# EAGLE design kachisys_board (EAGLE 9.0.0)
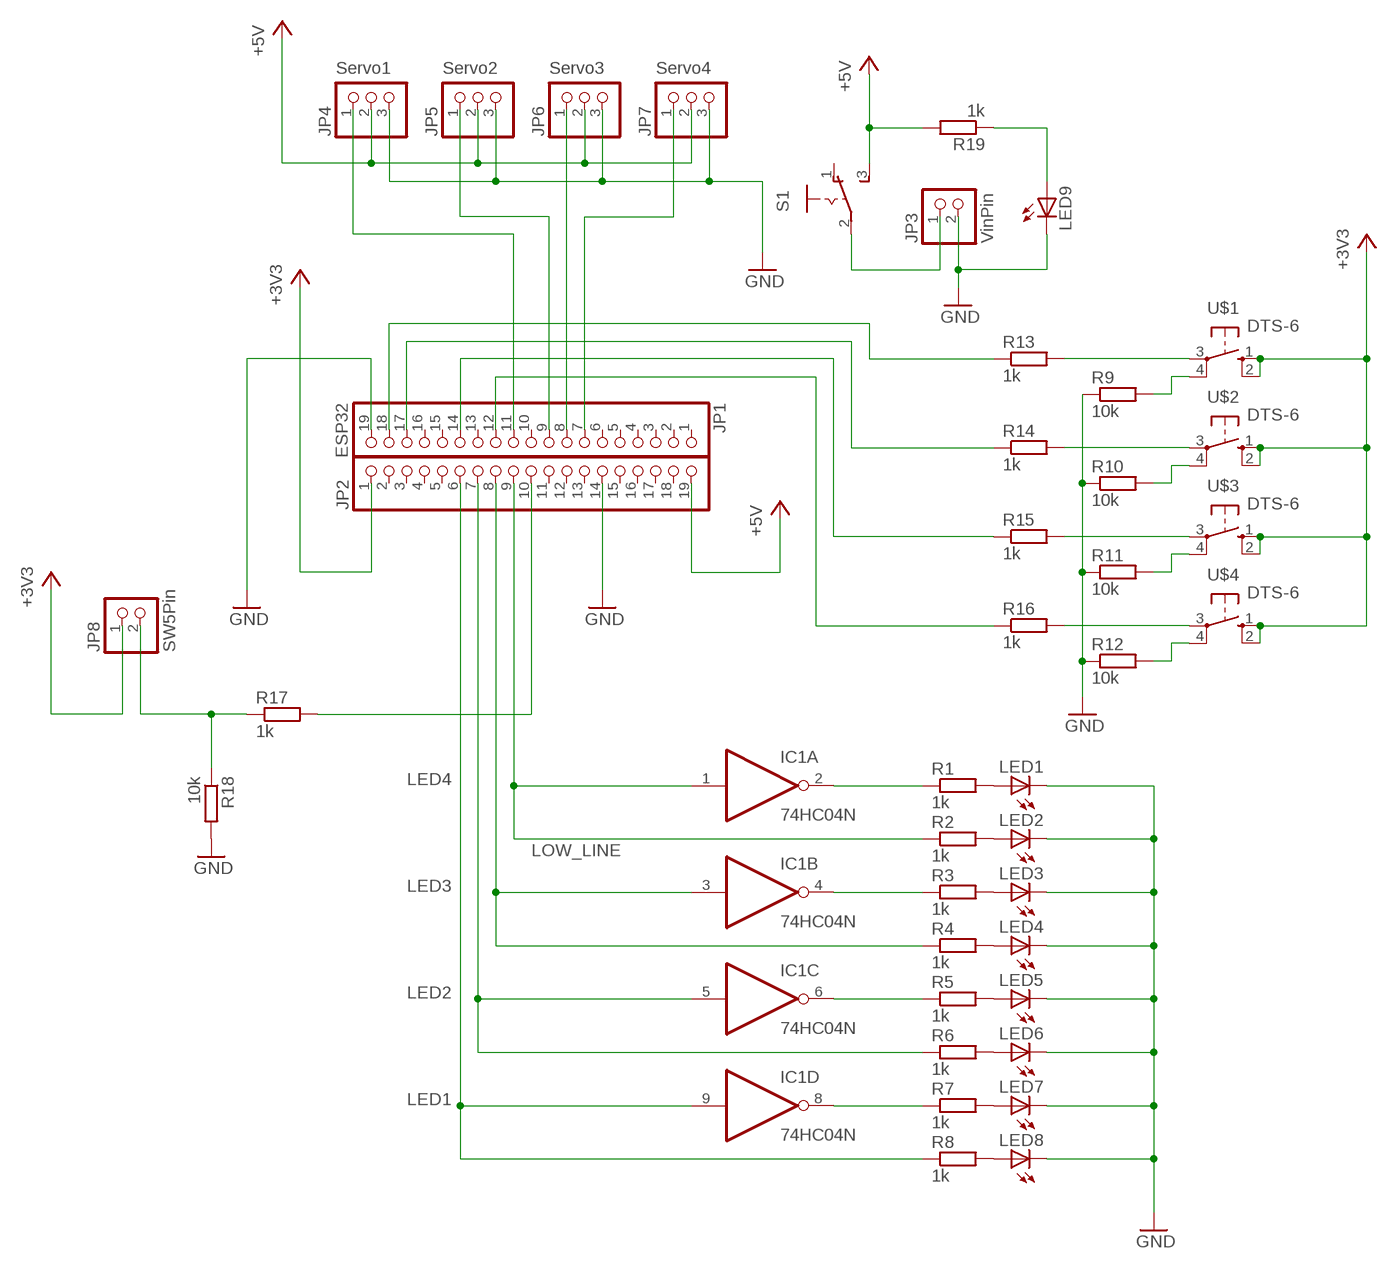
[diagram p0: schematic, sheet 1]

## Parts
IC1  74HC04N  [DIL14]
JP1  ESP32  PINHD-1X19  [1X19]
JP2  PINHD-1X19  [1X19]
JP3  VinPin  PINHD-1X2/90  [1X02/90]
JP4  PINHD-1X3  [1X03]
JP5  PINHD-1X3  [1X03]
JP6  PINHD-1X3  [1X03]
JP7  PINHD-1X3  [1X03]
JP8  SW5Pin  PINHD-1X2/90  [1X02/90]
LED1  LED3MM  [LED3MM]
LED2  LED3MM  [LED3MM]
LED3  LED3MM  [LED3MM]
LED4  LED3MM  [LED3MM]
LED5  LED3MM  [LED3MM]
LED6  LED3MM  [LED3MM]
LED7  LED3MM  [LED3MM]
LED8  LED3MM  [LED3MM]
LED9  LED3MM  [LED3MM]
R1  1k  R-EU_M2012  [M2012]
R2  1k  R-EU_M2012  [M2012]
R3  1k  R-EU_M2012  [M2012]
R4  1k  R-EU_M2012  [M2012]
R5  1k  R-EU_M2012  [M2012]
R6  1k  R-EU_M2012  [M2012]
R7  1k  R-EU_M2012  [M2012]
R8  1k  R-EU_M2012  [M2012]
R9  10k  R-EU_M2012  [M2012]
R10  10k  R-EU_M2012  [M2012]
R11  10k  R-EU_M2012  [M2012]
R12  10k  R-EU_M2012  [M2012]
R13  1k  R-EU_M2012  [M2012]
R14  1k  R-EU_M2012  [M2012]
R15  1k  R-EU_M2012  [M2012]
R16  1k  R-EU_M2012  [M2012]
R17  1k  R-EU_M2012  [M2012]
R18  10k  R-EU_M2012  [M2012]
R19  1k  R-EU_M2012  [M2012]
S1  255SB  [255SB]
U$1  DTS-6  [DTS6]
U$2  DTS-6  [DTS6]
U$3  DTS-6  [DTS6]
U$4  DTS-6  [DTS6]

## Nets
+3V3: JP2.1 JP8.1 U$1.1(S) U$1.2(S1) U$2.1(S) U$2.2(S1) U$3.1(S) U$3.2(S1) U$4.1(S) U$4.2(S1)
+5V [servoLine]: JP2.19 JP4.2 JP5.2 JP6.2 JP7.2 R19.2 S1.3(S)
GND [servoLine]: JP1.19 JP2.14 JP3.2 JP4.3 JP5.3 JP6.3 JP7.3 LED1.K(C) LED2.K(C) LED3.K(C) LED4.K(C) LED5.K(C) LED6.K(C) LED7.K(C) LED8.K(C) LED9.K(C) R9.1 R10.1 R11.1 R12.1 R18.2
N$1: IC1.9(D:I) JP2.6 R8.1
N$2: IC1.5(C:I) JP2.7 R6.1
N$3: IC1.3(B:I) JP2.8 R4.1
N$4: IC1.1(A:I) JP2.9 R2.1
N$5: IC1.2(A:O) R1.1
N$6: IC1.4(B:O) R3.1
N$7: IC1.6(C:O) R5.1
N$8: IC1.8(D:O) R7.1
N$9: LED1.A R1.2
N$10: LED2.A R2.2
N$11: LED3.A R3.2
N$12: LED4.A R4.2
N$13: LED5.A R5.2
N$14: LED6.A R6.2
N$15: LED7.A R7.2
N$16: LED8.A R8.2
N$17: R9.2 U$1.4(P1)
N$18: R10.2 U$2.4(P1)
N$19: R11.2 U$3.4(P1)
N$20: R12.2 U$4.4(P1)
N$21: JP8.2 R17.1 R18.1
N$22: R13.2 U$1.3(P)
N$23: R14.2 U$2.3(P)
N$24: R15.2 U$3.3(P)
N$25: JP1.7 JP7.1
N$26: JP1.8 JP6.1
N$27: JP1.9 JP5.1
N$28: JP1.11 JP4.1
N$29: R16.2 U$4.3(P)
N$30: JP1.12 R16.1
N$31: JP1.14 R15.1
N$32: JP1.17 R14.1
N$33: JP1.18 R13.1
N$34 [servoLine]: JP3.1 S1.2(P)
N$35 [servoLine]: LED9.A R19.1
N$37: JP2.10 R17.2
Unconnected: IC1.10(E:O) IC1.11(E:I) IC1.12(F:O) IC1.13(F:I) JP1.1 JP1.2 JP1.3 JP1.4 JP1.5 JP1.6 JP1.10 JP1.13 JP1.15 JP1.16 JP2.2 JP2.3 JP2.4 JP2.5 JP2.11 JP2.12 JP2.13 JP2.15 JP2.16 JP2.17 JP2.18 S1.1(O)

## Notes on the sheet
- Servo1 | Servo2 | Servo3 | Servo4
- LED4
- LOW_LINE
- LED3
- LED2
- LED1

## Power pins joined to a net without a drawn wire
GND: IC1.7(P:GND)
VCC: IC1.14(P:VCC)

## Library data of the parts
IC1 = 74xx-eu:74*04: Hex INVERTER
JP1 JP2 = pinhead:PINHD-1X19: PIN HEADER
JP3 JP8 = pinhead:PINHD-1X2: PIN HEADER
JP4-JP7 = pinhead:PINHD-1X3: PIN HEADER
LED1-LED9 = 150927 Library by matsu:LED: LED OSRAM: - CHIPLED LG R971, LG N971, LY N971, LG Q971, LY Q971, LO R971, LY R971 LH N974, LH R974 LS Q976, LO Q976, LY Q976 LO Q996 - Hyper CHIPLED LW Q18S LB Q993, LB Q99A, LB R99A - SideLED LS A670, LO A670, LY A670, LG A670, LP A670 LB A673, LV A673, LT A673, LW A673 LH A674 LY A675 LS A676, LA A676, LO A676, LY A676, LW A676 LS A679, LY A679, LG A679 - Hyper Micro SIDELED® LS Y876, LA Y876, LO Y876, LY Y876 LT Y87S - SmartLED LW L88C, LW L88S LB L89C, LB L89S, LG L890 LS L89K, LO L89K, LY L89K LS L896, LA L896, LO L896, LY L896 - TOPLED LS T670, LO T670, LY T670, LG T670, LP T670 LSG T670, LSP T670, LSY T670, LOP T670, LYG T670 LG T671, LOG T671, LSG T671 LB T673, LV T673, LT T673, LW T673 LH T674 LS T676, LA T676, LO T676, LY T676, LB T676, LH T676, LSB T676, LW T676 LB T67C, LV T67C, LT T67C, LS T67K, LO T67K, LY T67K, LW E67C LS E67B, LA E67B, LO E67B, LY E67B, LB E67C, LV E67C, LT E67C LW T67C LS T679, LY T679, LG T679 LS T770, LO T770, LY T770, LG T770, LP T770 LB T773, LV T773, LT T773, LW T773 LH T774 LS E675, LA E675, LY E675, LS T675 LS T776, LA T776, LO T776, LY T776, LB T776 LHGB T686 LT T68C, LB T68C - Hyper Mini TOPLED® LB M676 - Mini TOPLED Santana® LG M470 LS M47K, LO M47K, LY M47K Source: http://www.osram.convergy.de LUXEON: - LUMILED® LXK2-PW12-R00, LXK2-PW12-S00, LXK2-PW14-U00, LXK2-PW14-V00 LXK2-PM12-R00, LXK2-PM12-S00, LXK2-PM14-U00 LXK2-PE12-Q00, LXK2-PE12-R00, LXK2-PE12-S00, LXK2-PE14-T00, LXK2-PE14-U00 LXK2-PB12-K00, LXK2-PB12-L00, LXK2-PB12-M00, LXK2-PB14-N00, LXK2-PB14-P00, LXK2-PB14-Q00 LXK2-PR12-L00, LXK2-PR12-M00, LXK2-PR14-Q00, LXK2-PR14-R00 LXK2-PD12-Q00, LXK2-PD12-R00, LXK2-PD12-S00 LXK2-PH12-R00, LXK2-PH12-S00 LXK2-PL12-P00, LXK2-PL12-Q00, LXK2-PL12-R00 Source: www.luxeon.com KINGBRIGHT: KA-3528ASYC Source: www.kingbright.com
R1-R19 = 150927 Library by matsu:R-EU_: RESISTOR, European symbol
S1 = switch:255SB: SLIDING SWITCH Distributor Buerklin, 11G810
U$1-U$4 = 150927 Library by matsu:DTS-6: AKIZUKIDENSHI, Cosland Co,. Ltd. TACT SWITCH DTS-6 http://akizukidenshi.com/download/ds/cosland/DTS-6-V.PDF

## Net classes
0 default: width 0.508 mm
1 servoLine: width 1.016 mm

## Board
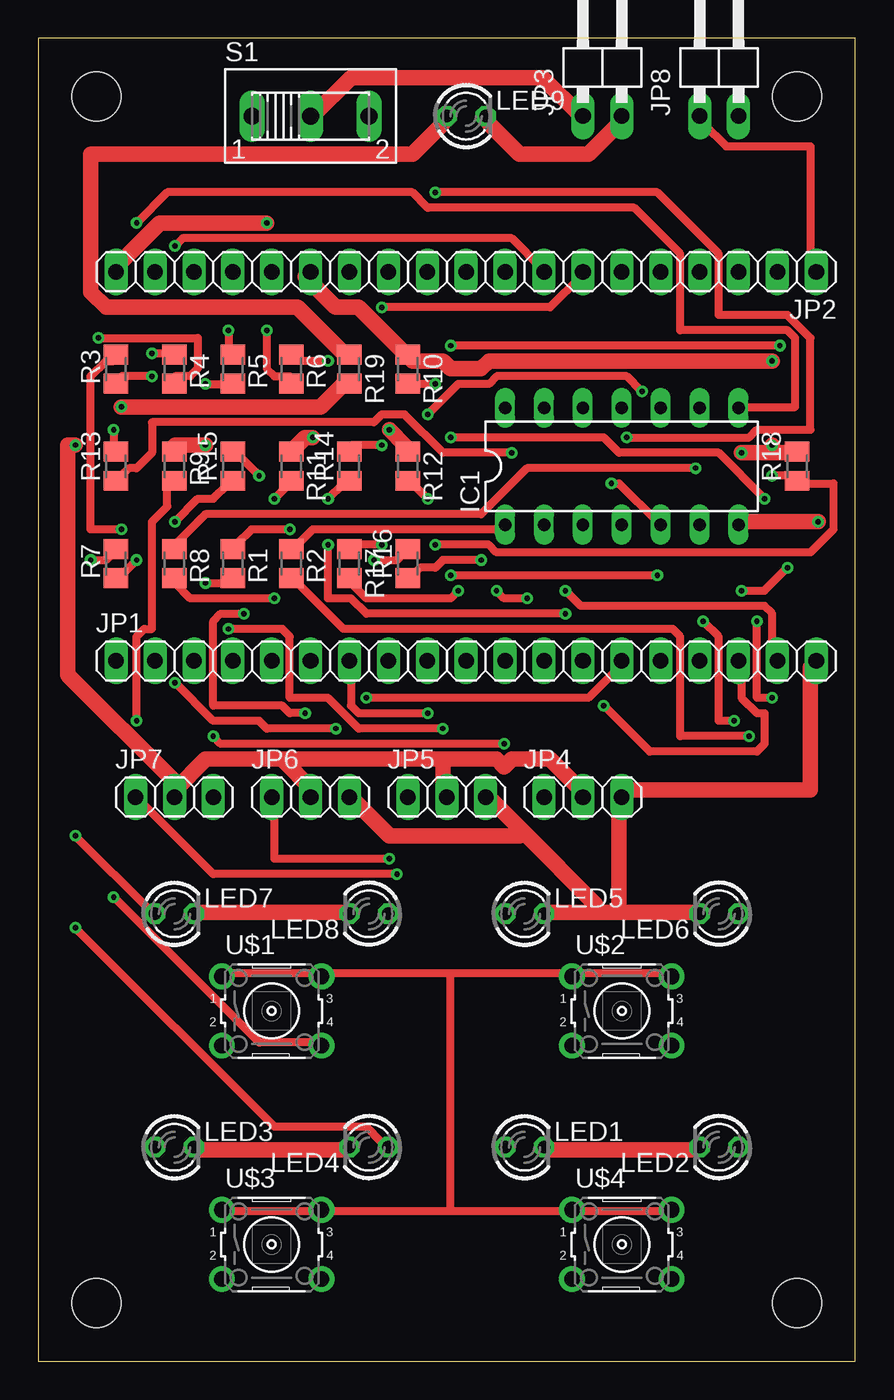
[diagram p1: board, top side]
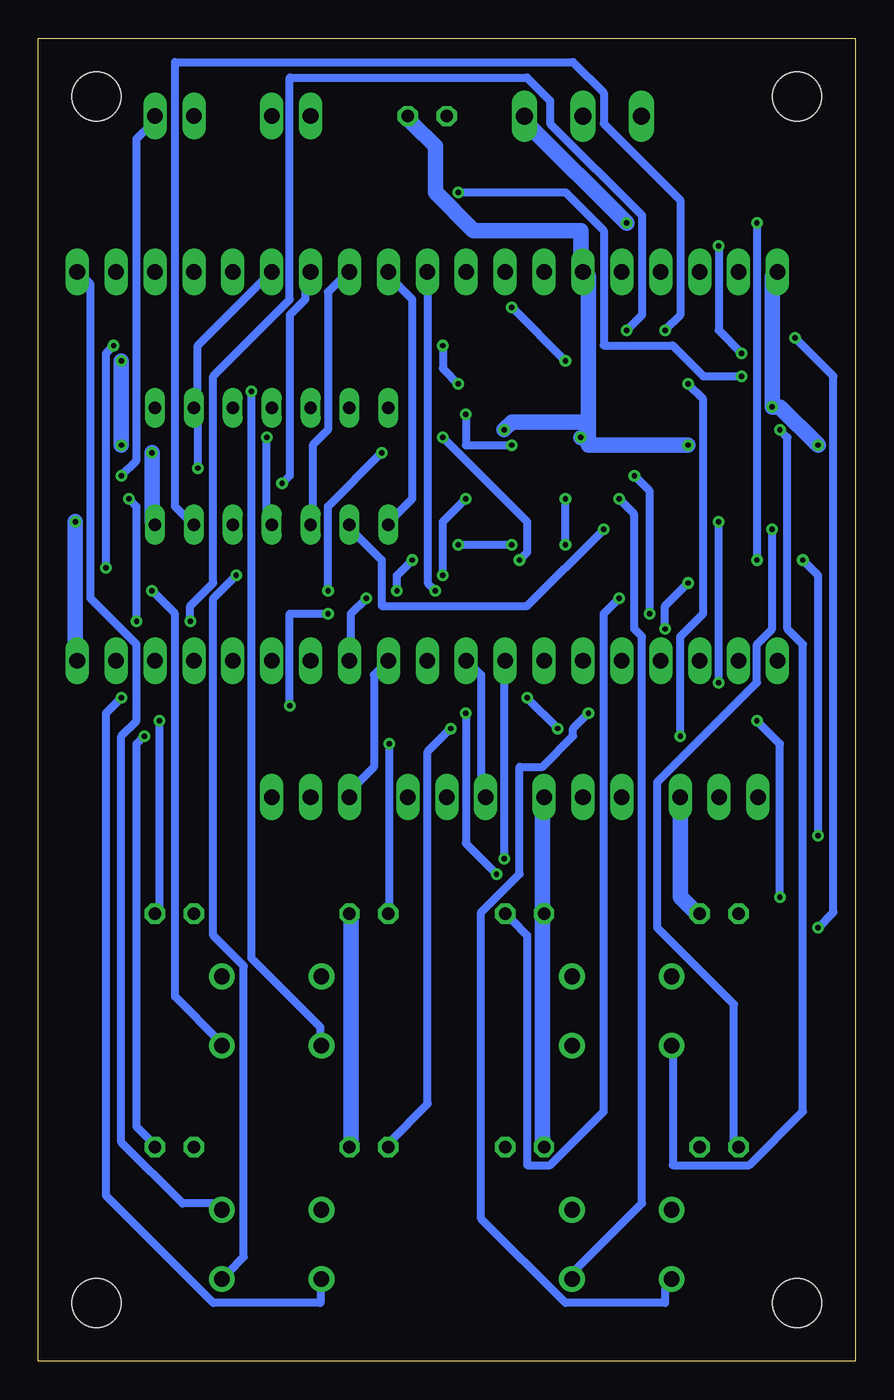
[diagram p2: board, bottom side, seen from below]

Size 53.34 x 86.36 mm. Coordinates in mm from the lower left corner, seen from the top.
Outline: 0,0 53.34,0 53.34,86.36 0,86.36 0,0
Copper layers (1*16): Top 0.035mm / dielectric 1.5mm / Bottom 0.035mm
Design rules "default": minimum track width 6mil, minimum drill 0.35mm, track to track 6mil, track to pad 6mil, pad to pad 6mil, via to via 6mil, smd to smd 6mil, copper to edge 40mil, drill to drill 6mil, minimum pad ring 10mil, minimum via ring 8mil, stop-mask expansion 4mil, vias tented up to drill 0mil, thermal gap 10mil
Holes 3.2 mm at 3.81,3.81 49.53,3.81 3.81,82.55 49.53,82.55

### Footprints (pad centres in the part's own frame; a part is rotated, then mirrored left to right if it is on the bottom)
DIL14 = drill 0.813 long: 1 -7.62,-3.81; 2 -5.08,-3.81; 3 -2.54,-3.81; 4 0,-3.81; 5 2.54,-3.81; 6 5.08,-3.81; 7 7.62,-3.81; 8 7.62,3.81; 9 5.08,3.81; 10 2.54,3.81; 11 0,3.81; 12 -2.54,3.81; 13 -5.08,3.81; 14 -7.62,3.81
1X19 = drill 1.016 long: 1 -22.86,0; 2 -20.32,0; 3 -17.78,0; 4 -15.24,0; 5 -12.7,0; 6 -10.16,0; 7 -7.62,0; 8 -5.08,0; 9 -2.54,0; 10 0,0; 11 2.54,0; 12 5.08,0; 13 7.62,0; 14 10.16,0; 15 12.7,0; 16 15.24,0; 17 17.78,0; 18 20.32,0; 19 22.86,0
1X02/90 = drill 1.016 long: 1 -1.27,-3.81; 2 1.27,-3.81
1X03 = drill 1.016 long: 1 -2.54,0; 2 0,0; 3 2.54,0
LED3MM = drill 0.813 octagon: A -1.27,0; K 1.27,0
M2012 = smd 1.3 x 1.6: 1 -0.95,0; 2 0.95,0
255SB = drill 1.118 long: 1 -3.81,0; 2 0,0; 3 3.81,0
DTS6 = drill 1.016 pad 1.676: 1 -3.251,2.261; 2 3.251,2.261; 3 -3.251,-2.261; 4 3.251,-2.261

### Placement (x,y rotation side)
IC1  38.1,58.42 0 top
JP1  27.94,45.72 0 top
JP2  27.94,71.12 180 top
JP3  36.83,85.09 0 top
JP4  35.56,36.83 0 top
JP5  26.67,36.83 0 top
JP6  17.78,36.83 0 top
JP7  8.89,36.83 0 top
JP8  44.45,85.09 0 top
LED1  31.75,13.97 0 top
LED2  44.45,13.97 180 top
LED3  8.89,13.97 0 top
LED4  21.59,13.97 180 top
LED5  31.75,29.21 0 top
LED6  44.45,29.21 180 top
LED7  8.89,29.21 0 top
LED8  21.59,29.21 180 top
LED9  27.94,81.28 0 top
R1  12.7,52.07 270 top
R2  16.51,52.07 270 top
R3  5.08,64.77 90 top
R4  8.89,64.77 270 top
R5  12.7,64.77 270 top
R6  16.51,64.77 270 top
R7  5.08,52.07 90 top
R8  8.89,52.07 270 top
R9  8.89,58.42 270 top
R10  24.13,64.77 270 top
R11  16.51,58.42 270 top
R12  24.13,58.42 270 top
R13  5.08,58.42 90 top
R14  20.32,58.42 90 top
R15  12.7,58.42 90 top
R16  24.13,52.07 90 top
R17  20.32,52.07 270 top
R18  49.53,58.42 90 top
R19  20.32,64.77 270 top
S1  17.78,81.28 0 top
U$1  15.24,22.86 0 top
U$2  38.1,22.86 0 top
U$3  15.24,7.62 0 top
U$4  38.1,7.62 0 top

### Tracks (layer width: path | path; a pad name or v marks a point on that pad's centre or on a via)
+3V3
  Top 0.508: U$1.1 12.42,25.3 18.42,25.3 U$1.2 18.92,25.3 26.92,25.3 | U$2.2 40.92,25.3 34.92,25.3 U$2.1 34.42,25.3 26.92,25.3 | JP2.1 50.42,71.3 50.42,79.3 44.92,79.3 43.42,80.8 JP8.1 | U$3.1 12.42,9.8 18.42,9.8 U$3.2 18.92,9.8 26.92,9.8 | U$4.2 40.92,9.8 34.92,9.8 U$4.1 34.42,9.8 26.92,9.8 | 26.92,9.8 26.92,25.3
  Bottom 0.508: JP2.1 50.42,70.8 49.92,70.3 49.92,49.8 46.92,46.8 46.92,41.8 47.92,40.8 47.92,14.3 43.92,10.3 41.42,10.3 U$4.2
+5V  (via drill 0.35)
  Top 1.016: 15.92,39.3 10.92,39.3 8.92,37.3 JP7.2 8.92,37.8 1.92,44.8 1.92,59.8 v2.42,59.8 | 15.92,39.3 17.92,37.3 JP6.2 | 26.42,39.3 26.42,37.3 JP5.2 | 15.92,39.3 26.42,39.3 | 26.42,39.3 29.92,39.3 30.42,38.8 30.92,39.3 33.42,39.3 35.42,37.3 JP4.2 | v5.42,62.3 18.42,62.3 19.92,63.8 R19.2 | v14.92,74.3 7.92,74.3 4.92,71.3 JP2.19
  Bottom 1.016: JP2.19 5.42,70.8 v5.42,62.3 4.92,62.3 v2.42,59.8 | v14.92,74.3 21.42,80.8 S1.3
GND  (via drill 0.35)
  Top 1.016: LED9.K 29.42,80.8 31.42,78.8 35.92,78.8 37.92,80.8 JP3.2 | v10.92,59.8 8.92,59.8 R9.1 | v17.92,60.3 17.42,60.3 16.92,59.8 R11.1 | v22.92,60.8 23.92,59.8 R12.1 | JP2.14 17.42,70.8 19.42,68.8 20.92,68.8 23.92,65.8 R10.1 24.42,65.3 26.42,65.3 26.92,64.8 28.92,64.8 29.42,65.3 v47.92,65.3 | LED3.K 10.42,13.8 19.92,13.8 LED4.K | LED8.K 19.92,29.3 10.42,29.3 LED7.K | LED1.K 33.42,13.8 42.92,13.8 LED2.K | v45.92,59.3 47.92,59.3 | 47.92,59.3 49.42,59.3 R18.2 | 37.92,29.3 42.92,29.3 LED6.K | 37.92,29.3 36.42,29.3 | 36.42,29.3 33.42,29.3 LED5.K | 31.67,34.55 36.42,29.8 36.42,29.3 | 31.67,34.55 29.42,36.8 JP5.3 | 37.92,29.3 37.92,36.8 JP4.3 38.42,37.3 50.42,37.3 50.42,45.3 JP1.19 | v50.92,54.8 45.92,54.8 IC1.7 | JP6.3 20.42,36.8 22.92,34.3 31.42,34.3 31.67,34.55 | v47.92,59.8 47.92,59.3
  Bottom 1.016: v10.92,59.8 17.42,59.8 17.42,60.3 | 17.42,61.3 17.42,70.8 JP2.14 17.92,71.3 17.92,73.8 24.92,73.8 27.42,76.3 27.42,79.3 28.92,80.8 LED9.K | 17.42,61.3 17.42,60.3 | v17.92,60.3 17.42,60.3 | v22.92,60.8 22.42,61.3 17.42,61.3 | JP6.3 20.42,36.8 20.42,29.3 LED8.K 20.42,28.8 20.42,14.3 LED4.K | LED7.K 10.42,29.3 11.42,30.3 11.42,36.8 JP7.3 | v45.92,59.3 45.92,54.8 IC1.7 | v50.92,54.8 50.92,45.8 JP1.19 | LED1.K 32.92,14.3 32.92,28.8 LED5.K | v47.92,59.8 v47.92,65.3
N$1  (via drill 0.35)
  Top 0.508: v42.92,58.3 31.92,58.3 28.92,55.3 10.92,55.3 8.92,53.3 R8.1
  Bottom 0.508: v42.92,58.3 42.92,61.8 IC1.9 42.92,62.3 42.92,66.3 JP2.6
N$2  (via drill 0.35)
  Top 0.508: v18.92,65.3 16.92,65.3 R6.1 | v22.42,68.8 33.42,68.8 35.42,70.8 JP2.7 | v37.42,57.3 37.92,57.3 40.42,54.8 IC1.5
  Bottom 0.508: v22.42,68.8 v18.92,65.3 | v37.42,57.3 36.92,57.8 36.92,68.3 35.92,69.3 35.92,70.8 JP2.7
N$3  (via drill 0.35)
  Top 0.508: v7.42,65.8 8.42,65.8 R4.1 | v8.92,72.8 9.42,73.3 30.92,73.3 32.92,71.3 JP2.8
  Bottom 0.508: v7.42,65.8 8.92,67.3 v8.92,72.8 | IC1.3 35.42,54.8 35.42,59.8 34.42,60.8 34.42,69.8 33.42,70.8 JP2.8
N$4
  Top 0.508: R2.1 16.92,53.3 17.92,54.3 30.42,54.3 IC1.1
  Bottom 0.508: JP2.9 30.42,70.8 28.92,69.3 28.92,56.3 30.42,54.8 IC1.1
N$5  (via drill 0.35)
  Top 0.508: v16.42,54.3 13.92,54.3 12.92,53.3 R1.1
  Bottom 0.508: v16.42,54.3 21.42,49.3 30.92,49.3 30.92,52.3 32.92,54.3 IC1.2
N$6  (via drill 0.35)
  Top 0.508: v7.42,64.3 5.42,64.3 R3.1 | v25.92,76.3 40.42,76.3 44.42,72.3 44.42,68.3 48.92,68.3 50.42,66.8 50.42,60.8 46.92,60.8 46.42,60.3 v38.42,60.3
  Bottom 0.508: v7.42,64.3 9.92,64.3 11.92,66.3 16.42,66.3 16.42,73.8 18.92,76.3 v25.92,76.3 | v38.42,60.3 38.42,54.8 IC1.4
N$7  (via drill 0.35)
  Top 0.508: v12.42,67.3 12.42,65.8 R5.1
  Bottom 0.508: v12.42,67.3 11.42,68.3 11.42,75.8 16.42,80.8 16.42,82.8 18.42,84.8 44.42,84.8 44.42,55.8 43.42,54.8 IC1.6
N$8  (via drill 0.35)
  Top 0.508: v6.42,52.3 5.42,51.3 R7.1 | v6.42,74.3 8.42,76.3 24.42,76.3 25.42,75.3 38.92,75.3 41.92,72.3 41.92,67.3 48.92,67.3 49.42,66.8 49.42,62.3 45.92,62.3 IC1.8
  Bottom 0.508: v6.42,74.3 v6.42,52.3
N$9  (via drill 0.35)
  Top 0.508: v10.92,50.8 12.42,50.8 R1.2 | v12.42,47.8 15.92,47.8 16.42,47.3 16.42,43.3 18.92,43.3 20.92,41.3 v26.42,41.3
  Bottom 0.508: v10.92,50.8 12.42,49.3 v12.42,47.8 | v26.42,41.3 27.92,39.8 27.92,16.8 30.42,14.3 LED1.A
N$10  (via drill 0.35)
  Top 0.508: v46.42,40.8 41.92,40.8 41.92,47.3 41.42,47.8 19.92,47.8 16.92,50.8 R2.2
  Bottom 0.508: v46.42,40.8 46.92,40.3 46.92,15.3 45.92,14.3 LED2.A
N$11  (via drill 0.35)
  Top 0.508: v5.42,54.3 3.42,54.3 3.42,64.3 4.42,65.3 4.92,65.3 R3.2
  Bottom 0.508: v5.42,54.3 5.42,47.8 6.42,46.8 6.42,44.3 12.92,37.8 12.92,28.3 7.92,23.3 7.92,14.3 LED3.A
N$12  (via drill 0.35)
  Top 0.508: v3.92,66.8 10.42,66.8 10.42,64.8 9.92,64.3 8.92,64.3 R4.2 | v2.42,28.3 15.42,15.3 21.42,15.3 22.42,14.3 LED4.A
  Bottom 0.508: v3.92,66.8 1.42,64.3 1.42,29.3 v2.42,28.3
N$13  (via drill 0.35)
  Top 0.508: v10.92,63.8 12.42,63.8 R5.2 | v11.42,40.8 11.92,40.3 v30.42,40.3
  Bottom 0.508: v10.92,63.8 9.92,62.8 9.92,48.8 11.42,47.3 v11.42,40.8 | v30.42,40.3 30.42,29.3 LED5.A
N$14  (via drill 0.35)
  Top 0.508: v14.92,67.3 14.92,64.8 15.42,64.3 16.42,64.3 R6.2 | v43.42,48.3 44.42,47.3 44.42,41.8 v45.42,41.8
  Bottom 0.508: v14.92,67.3 13.92,68.3 13.92,74.8 19.92,80.8 19.92,82.3 21.42,83.8 36.92,83.8 36.92,69.3 41.92,64.3 41.92,50.8 43.42,49.3 v43.42,48.3 | v45.42,41.8 45.42,29.3 LED6.A
N$15  (via drill 0.35)
  Top 0.508: v3.42,52.3 4.42,52.3 4.92,52.8 R7.2 | v2.42,34.3 7.42,29.3 LED7.A
  Bottom 0.508: v3.42,52.3 2.42,51.3 v2.42,34.3
N$16  (via drill 0.35)
  Top 0.508: v15.42,49.8 9.92,49.8 8.92,50.8 R8.2
  Bottom 0.508: v15.42,49.8 16.42,48.8 16.42,16.3 19.92,12.8 21.42,12.8 21.42,27.8 22.42,28.8 LED8.A
N$17  (via drill 0.35)
  Top 0.508: v6.42,41.8 6.42,47.3 6.92,47.8 7.42,47.8 7.42,54.8 8.42,55.8 8.42,57.3 R9.2 | v4.92,30.3 14.42,20.8 18.42,20.8 U$1.4
  Bottom 0.508: v6.42,41.8 4.92,40.3 v4.92,30.3
N$18  (via drill 0.35)
  Top 0.508: v25.92,63.8 24.42,63.8 R10.2 | v48.42,66.3 v26.92,66.3 | v48.92,51.8 47.42,50.3 v45.92,50.3
  Bottom 0.508: v25.92,63.8 26.92,64.8 v26.92,66.3 | v48.42,66.3 48.92,65.8 v48.92,51.8 | v45.92,50.3 44.42,48.8 44.42,23.8 41.42,20.8 U$2.4
N$19  (via drill 0.35)
  Top 0.508: v15.42,56.3 16.42,57.3 R11.2
  Bottom 0.508: v15.42,56.3 14.42,55.3 14.42,47.8 13.92,47.3 13.92,10.3 18.42,5.8 U$3.4
N$20  (via drill 0.35)
  Top 0.508: v25.42,56.3 24.42,57.3 R12.2 | v40.42,51.3 v26.92,51.3
  Bottom 0.508: v25.42,56.3 26.92,54.8 v26.92,51.3 | v40.42,51.3 41.92,49.8 41.92,27.8 39.92,25.8 39.92,6.8 40.92,5.8 U$4.4
N$21  (via drill 0.35)
  Top 0.508: v22.42,53.3 20.42,53.3 R17.1 | v25.92,53.3 29.42,53.3 29.92,52.8 50.42,52.8 51.92,54.3 51.92,57.3 49.92,57.3 R18.1 49.42,57.8 v47.92,57.8
  Bottom 0.508: v25.92,53.3 v22.42,53.3 | v47.92,57.8 46.92,58.8 46.92,79.8 45.92,80.8 JP8.2
N$22  (via drill 0.35)
  Top 0.508: v4.92,60.8 4.92,59.8 R13.2
  Bottom 0.508: v4.92,60.8 4.42,60.3 4.42,47.8 3.42,46.8 3.42,16.3 6.92,12.8 11.92,12.8 11.92,20.3 U$1.3
N$23  (via drill 0.35)
  Top 0.508: v22.42,59.8 20.42,59.8 R14.2 | v25.42,61.8 27.42,63.8 29.42,63.8 29.92,64.3 38.42,64.3 v39.42,63.3
  Bottom 0.508: v22.42,59.8 25.42,59.8 v25.42,61.8 | v39.42,63.3 39.42,26.3 34.92,21.8 34.92,20.8 U$2.3
N$24  (via drill 0.35)
  Top 0.508: v14.42,57.8 12.92,59.3 R15.2 | v13.42,48.8 11.92,48.8 11.42,48.3 11.42,42.8 15.92,42.8 16.42,42.3 v17.42,42.3
  Bottom 0.508: v14.42,57.8 13.42,56.8 v13.42,48.8 | v17.42,42.3 18.42,41.3 18.42,40.8 20.42,38.8 21.92,38.8 21.92,31.8 24.42,29.3 24.42,9.3 18.92,3.8 12.42,3.8 12.42,5.3 U$3.3
N$25  (via drill 0.35)
  Top 0.508: v23.42,31.8 11.42,31.8 6.42,36.8 JP7.1 | v25.42,42.3 20.92,42.3 20.42,42.8 20.42,45.3 JP1.7
  Bottom 0.508: v23.42,31.8 25.42,33.8 v25.42,42.3
N$26  (via drill 0.35)
  Top 0.508: v22.92,32.8 15.42,32.8 15.42,36.8 JP6.1
  Bottom 0.508: v22.92,32.8 22.92,45.3 JP1.8
N$27
  Bottom 0.508: JP5.1 24.42,37.3 24.42,44.8 24.92,45.3 JP1.9
N$28
  Bottom 0.508: JP4.1 32.92,37.3 31.42,38.8 31.42,44.8 30.92,45.3 JP1.11
N$29  (via drill 0.35)
  Top 0.508: v21.92,52.3 23.42,52.3 23.92,52.8 R16.2 | v26.92,60.3 36.92,60.3 37.92,59.3 44.42,59.3 v47.42,56.3 | v46.92,48.3 46.92,43.3 v47.92,43.3
  Bottom 0.508: v21.92,52.3 21.42,52.8 21.42,54.8 v26.92,60.3 | v47.42,56.3 46.92,55.8 v46.92,48.3 | v47.92,43.3 48.92,42.3 48.92,10.8 41.92,3.8 34.92,3.8 34.92,5.3 U$4.3
N$30  (via drill 0.35)
  Top 0.508: v28.92,52.3 26.42,52.3 25.92,51.8 24.92,51.8 24.42,51.3 R16.1 | v29.92,50.3 30.42,49.8 v31.92,49.8
  Bottom 0.508: v28.92,52.3 29.92,51.3 v29.92,50.3 | v31.92,49.8 32.92,48.8 32.92,45.8 JP1.12
N$31  (via drill 0.35)
  Top 0.508: v8.92,54.8 10.42,56.3 11.42,56.3 12.42,57.3 R15.1 | v8.92,44.3 11.42,41.8 14.42,41.8 14.92,41.3 v19.42,41.3 | v21.42,43.3 35.92,43.3 37.92,45.3 JP1.14
  Bottom 0.508: v8.92,44.3 v8.92,54.8 | v21.42,43.3 v19.42,41.3
N$32  (via drill 0.35)
  Top 0.508: v18.92,56.3 19.92,57.3 R14.1 | v18.92,53.3 18.92,49.8 20.42,49.8 21.42,48.8 v34.42,48.8 | v36.92,42.8 39.92,39.8 46.92,39.8 47.42,40.3 47.42,42.3 46.92,42.3 45.92,43.3 45.92,45.3 JP1.17
  Bottom 0.508: v18.92,53.3 v18.92,56.3 | v34.42,48.8 36.92,48.8 v36.92,42.8
N$33  (via drill 0.35)
  Top 0.508: v30.92,59.3 26.42,59.3 23.92,61.8 22.42,61.8 21.92,61.3 7.42,61.3 7.42,59.3 6.42,58.3 5.92,58.3 5.42,57.8 R13.1 | v34.42,50.3 35.42,49.3 47.42,49.3 47.92,48.8 47.92,45.8 JP1.18
  Bottom 0.508: v30.92,59.3 34.42,55.8 v34.42,50.3
N$34
  Top 1.016: JP3.1 35.42,81.3 32.92,83.8 20.42,83.8 17.92,81.3 S1.2
N$35
  Top 1.016: R19.1 19.92,65.8 16.92,68.8 4.42,68.8 3.42,69.8 3.42,78.8 24.42,78.8 26.42,80.8 LED9.A
N$37  (via drill 0.35)
  Top 0.508: v27.42,50.3 26.92,49.8 21.42,49.8 20.42,50.8 R17.2
  Bottom 0.508: v27.42,50.3 27.92,50.8 27.92,70.8 JP2.10